# EAGLE design LiDAR_Demo_Board (EAGLE 9.2.2)
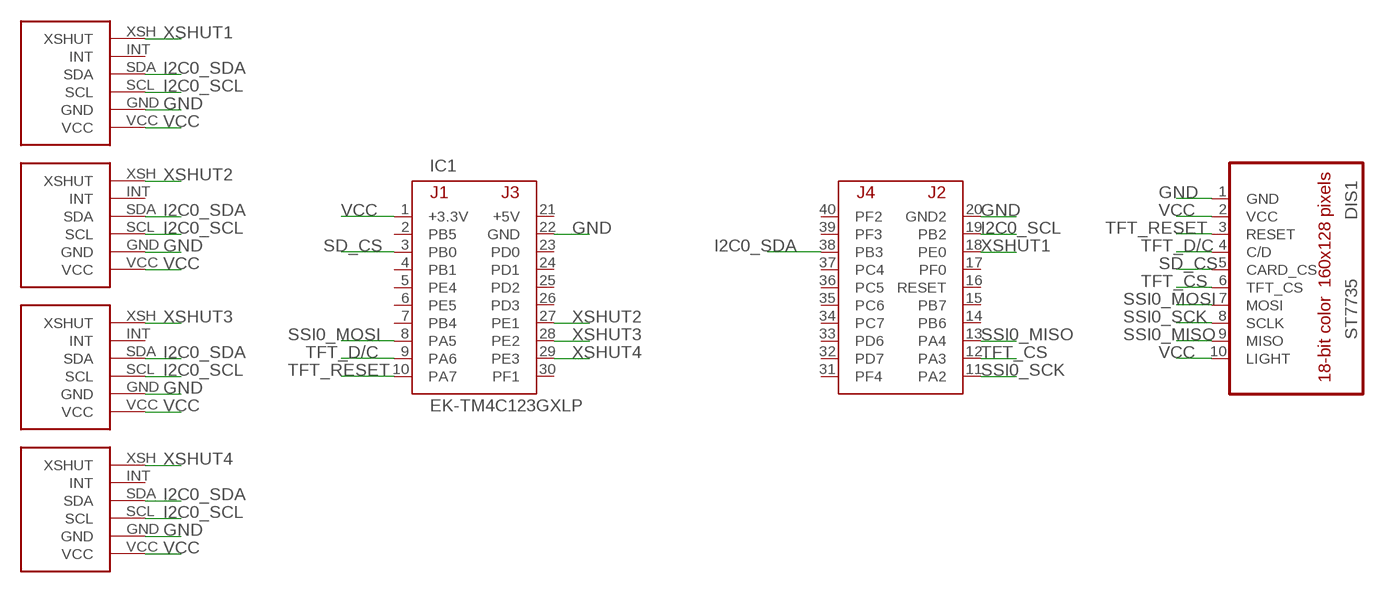
[diagram p0: schematic, sheet 1]

## Parts
DIS1  ST7735  [ST7735]
IC1  EK-TM4C123GXLP  [TM4C123LAUNCHPAD]
U$1  VL53L0X_ATK  [VL53L0X_ATK]
U$2  VL53L0X_ATK  [VL53L0X_ATK]
U$3  VL53L0X_ATK  [VL53L0X_ATK]
U$4  VL53L0X_ATK  [VL53L0X_ATK]

## Nets
GND: DIS1.1(GND) IC1.20(GND2) IC1.22(GND) U$1.GND U$2.GND U$3.GND U$4.GND
I2C0_SCL: IC1.19(PB2) U$1.SCL U$2.SCL U$3.SCL U$4.SCL
I2C0_SDA: IC1.38(PB3) U$1.SDA U$2.SDA U$3.SDA U$4.SDA
SD_CS: DIS1.5(CARD_CS) IC1.3(PB0)
SSI0_MISO: DIS1.9(MISO) IC1.13(PA4)
SSI0_MOSI: DIS1.7(MOSI) IC1.8(PA5)
SSI0_SCK: DIS1.8(SCLK) IC1.11(PA2)
TFT_CS: DIS1.6(TFT_CS) IC1.12(PA3)
TFT_D/C: DIS1.4(C/D) IC1.9(PA6)
TFT_RESET: DIS1.3(RESET) IC1.10(PA7)
VCC: DIS1.2(VCC) DIS1.10(LIGHT) IC1.1(+3.3V) U$1.VCC U$2.VCC U$3.VCC U$4.VCC
XSHUT1: IC1.18(PE0) U$1.XSH(XSHUT)
XSHUT2: IC1.27(PE1) U$2.XSH(XSHUT)
XSHUT3: IC1.28(PE2) U$3.XSH(XSHUT)
XSHUT4: IC1.29(PE3) U$4.XSH(XSHUT)
Unconnected: IC1.2(PB5) IC1.4(PB1) IC1.5(PE4) IC1.6(PE5) IC1.7(PB4) IC1.14(PB6) IC1.15(PB7) IC1.16(RESET) IC1.17(PF0) IC1.23(PD0) IC1.24(PD1) IC1.25(PD2) IC1.26(PD3) IC1.30(PF1) IC1.31(PF4) IC1.32(PD7) IC1.33(PD6) IC1.34(PC7) IC1.35(PC6) IC1.36(PC5) IC1.37(PC4) IC1.39(PF3) IC1.40(PF2) U$1.INT U$2.INT U$3.INT U$4.INT

## Power pins joined to a net without a drawn wire
+5V: IC1.21(+5V)

## Library data of the parts
DIS1 = UT_ECE:ST7735: Sitronix ST7735R 18-bit color, 1.8" TFT LCD display, 128*160, http://www.adafruit.com/products/358 // Backlight (pin 10) connected to +3.3 V // MISO (pin 9) PA4 (SSI0Rx) // SCK (pin 8) connected to PA2 (SSI0Clk) // MOSI (pin 7) connected to PA5 (SSI0Tx) // TFT_CS (pin 6) connected to PA3 (SSI0Fss) // CARD_CS (pin 5) connected to PD7 GPIO output(for SDC) // Data/Command (pin 4) connected to PA6 (GPIO), high for data, low for command // RESET (pin 3) connected to PA7 (GPIO) // VCC (pin 2) connected to +3.3 V // Gnd (pin 1) connected to ground; OC_FARNELL: unknown; OC_NEWARK: unknown
IC1 = UT_ECE:EK-TM4C123GXL: Texas Instruments TM4C123 LaunchPad EK-TM4C123GXL www.ti.com/tool/ek-tm4c123gxl
U$1-U$4 = Z:VL53L0X_ATK

## Board
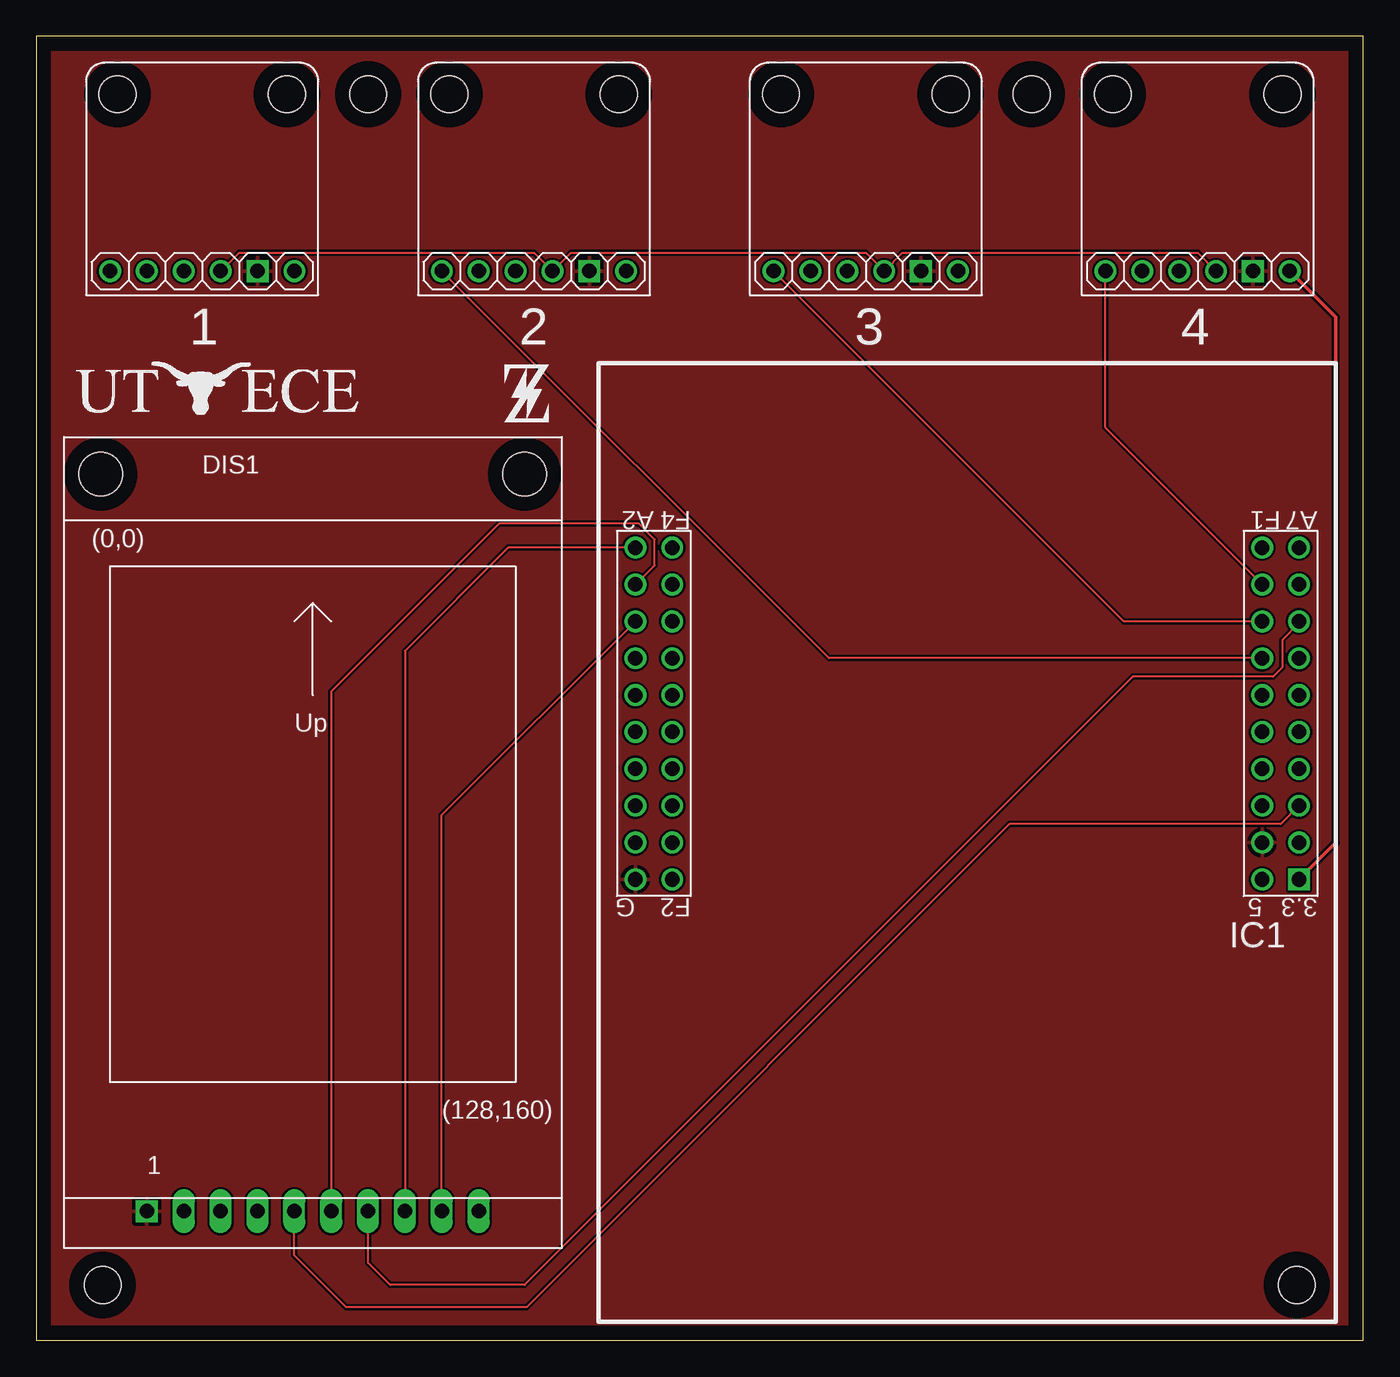
[diagram p1: board, top side]
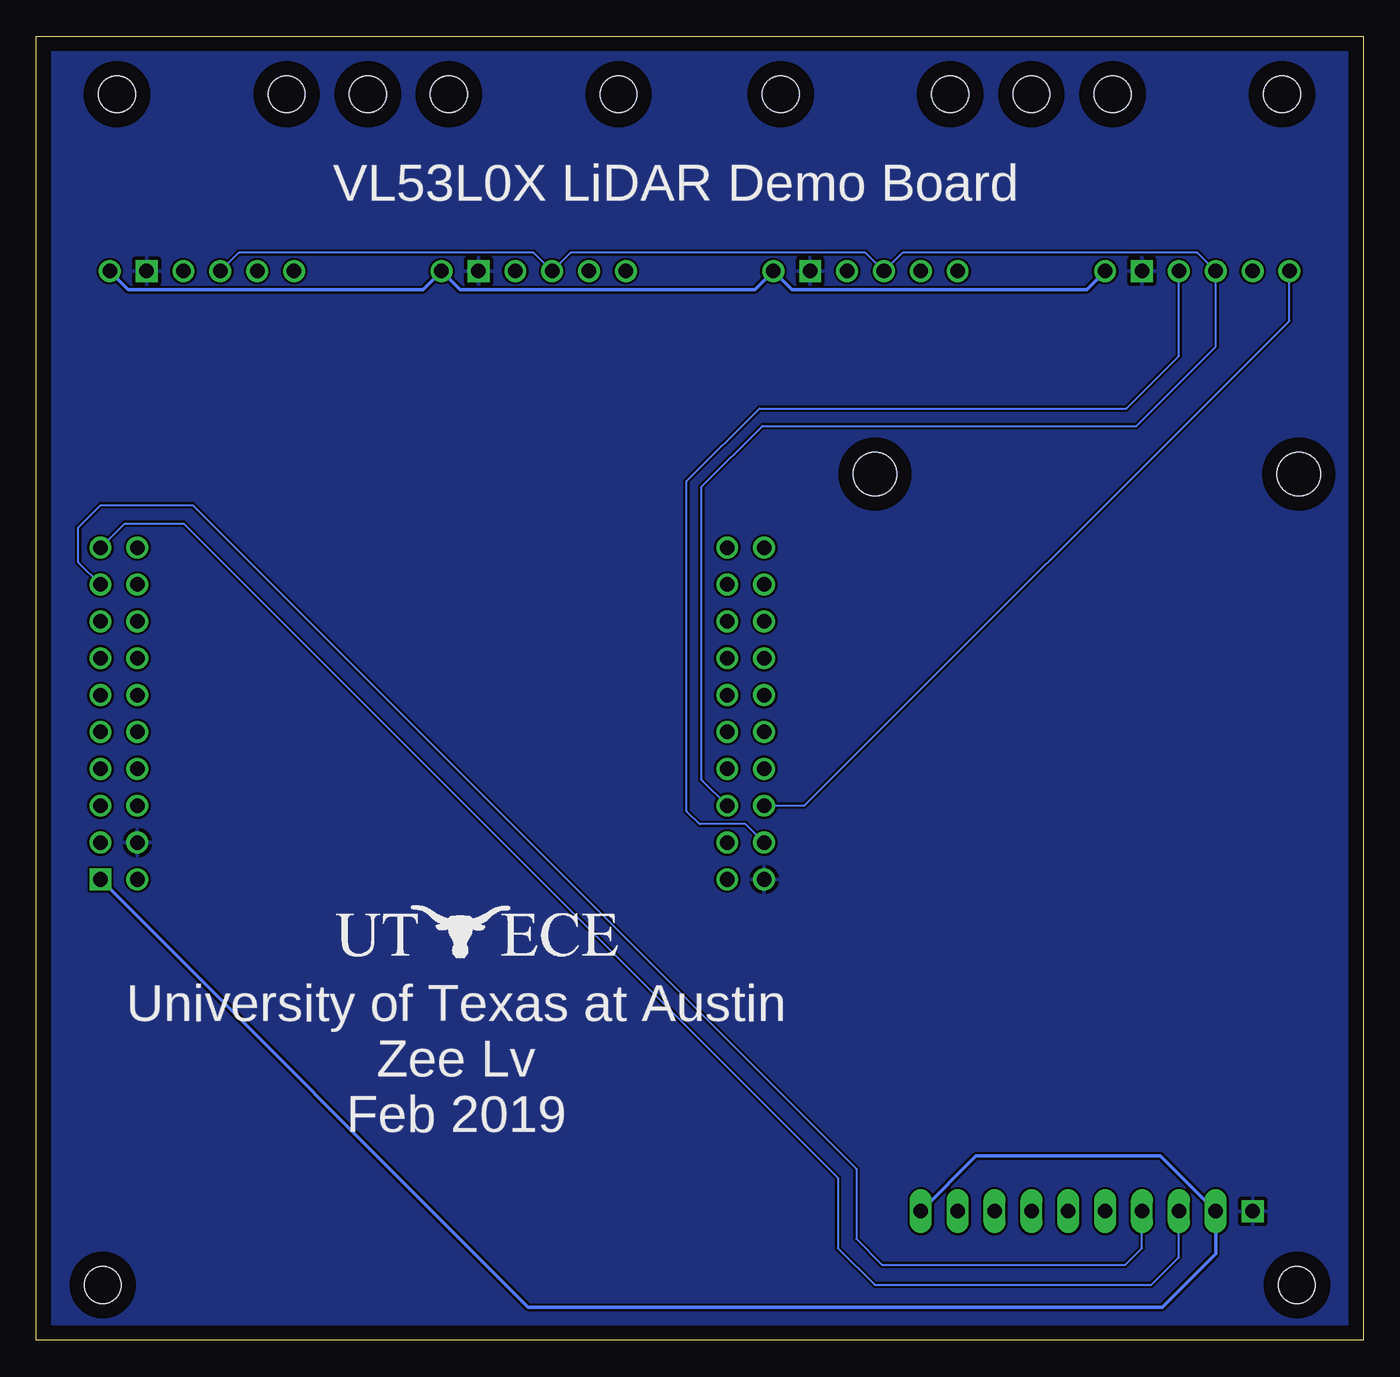
[diagram p2: board, bottom side, seen from below]

Size 91.42 x 89.84 mm. Coordinates in mm from the lower left corner, seen from the top.
Outline: 0,0 91.42,0 91.42,89.84 0,89.84 0,0
Copper layers (1*16): Top 0.035mm / dielectric 1.5mm / Bottom 0.035mm
Design rules "default": minimum track width 6mil, minimum drill 0.35mm, track to track 6mil, track to pad 6mil, pad to pad 6mil, via to via 6mil, smd to smd 6mil, copper to edge 40mil, drill to drill 6mil, minimum pad ring 10mil, minimum via ring 8mil, stop-mask expansion 4mil, vias tented up to drill 0mil, thermal gap 10mil
Holes 2.54 mm at 86.84,3.81 4.57,3.81 22.86,85.85 68.58,85.85

### Footprints (pad centres in the part's own frame; a part is rotated, then mirrored left to right if it is on the bottom)
ST7735 = drill 1 square: 1 -11.43,-30.48 | drill 1 long: 2 -8.89,-30.48; 3 -6.35,-30.48; 4 -3.81,-30.48; 5 -1.27,-30.48; 6 1.27,-30.48; 7 3.81,-30.48; 8 6.35,-30.48; 9 8.89,-30.48; 10 11.43,-30.48 | hole 3: -14.605,20.32; 14.605,20.32
TM4C123LAUNCHPAD = drill 1 square: 1 -22.86,12.7 | drill 1: 2 -22.86,10.16; 3 -22.86,7.62; 4 -22.86,5.08; 5 -22.86,2.54; 6 -22.86,0; 7 -22.86,-2.54; 8 -22.86,-5.08; 9 -22.86,-7.62; 10 -22.86,-10.16; 11 22.86,-10.16; 12 22.86,-7.62; 13 22.86,-5.08; 14 22.86,-2.54; 15 22.86,0; 16 22.86,2.54; 17 22.86,5.08; 18 22.86,7.62; 19 22.86,10.16; 20 22.86,12.7; 21 -20.32,12.7; 22 -20.32,10.16; 23 -20.32,7.62; 24 -20.32,5.08; 25 -20.32,2.54; 26 -20.32,0; 27 -20.32,-2.54; 28 -20.32,-5.08; 29 -20.32,-7.62; 30 -20.32,-10.16; 31 20.32,-10.16; 32 20.32,-7.62; 33 20.32,-5.08; 34 20.32,-2.54; 35 20.32,0; 36 20.32,2.54; 37 20.32,5.08; 38 20.32,7.62; 39 20.32,10.16; 40 20.32,12.7
VL53L0X_ATK = drill 1 square: GND 12.7,2.54 | drill 1: INT 5.08,2.54; SCL 10.16,2.54; SDA 7.62,2.54; VCC 15.24,2.54; XSH 2.54,2.54 | hole 2.54: 3.048,14.732; 14.732,14.732

### Placement (x,y rotation side)
DIS1  19.05,39.37 0 top
IC1  64.14,44.45 180 top
U$1  2.54,71.12 0 top
U$2  25.4,71.12 0 top
U$3  48.26,71.12 0 top
U$4  71.12,71.12 0 top
U$5  [LOGO_UT_ECE_20X4]  2.29,63.5 0 top
U$6  [LOGO_Z_3X4]  32.26,63.25 0 top
U$7  [LOGO_UT_ECE_20X4]  71.25,26.04 0 bottom

### Tracks (layer width: path | path; a pad name or v marks a point on that pad's centre or on a via)
GND
  pour Top: 0.13,89.66 0.13,0.13 91.31,0.13 91.31,89.66
  pour Bottom: 0.13,89.66 0.13,0.13 91.31,0.13 91.31,89.66
I2C0_SCL
  Top 0.152: U$1.SCL 13.97,74.93 34.29,74.93 U$2.SCL 36.83,74.93 57.15,74.93 U$3.SCL 59.69,74.93 80.01,74.93 U$4.SCL
  Bottom 0.152: IC1.19 42.55,35.56 45.72,35.56 46.61,36.45 46.61,59.18 41.59,64.2 16.32,64.2 12.7,67.82 U$1.SCL
I2C0_SDA
  Bottom 0.152: U$4.SDA 77.47,74.93 57.15,74.93 U$3.SDA 54.61,74.93 34.29,74.93 U$2.SDA 31.75,74.93 11.43,74.93 U$1.SDA 10.16,68.45 15.62,62.99 41.4,62.99 45.59,58.8 45.59,38.61 IC1.38
SD_CS
  Top 0.152: IC1.3 85.73,35.56 67.06,35.56 33.78,2.29 21.34,2.29 17.78,5.84 DIS1.5
SSI0_MISO
  Top 0.152: DIS1.9 27.94,36.2 IC1.13
SSI0_MOSI
  Top 0.152: IC1.8 86.99,49.4 85.85,48.26 85.85,46.35 85.22,45.72 75.57,45.72 33.66,3.81 24.38,3.81 22.86,5.33 DIS1.7
SSI0_SCK
  Top 0.152: IC1.11 32.51,54.61 25.4,47.5 DIS1.8
TFT_CS
  Top 0.152: IC1.12 42.48,53.28 42.55,53.34 42.61,53.4 42.61,55.18 41.53,56.26 31.88,56.26 20.32,44.7 DIS1.6
TFT_D/C
  Bottom 0.152: IC1.9 88.52,53.59 88.52,56.01 86.99,57.53 80.64,57.53 34.92,11.81 34.92,6.99 33.15,5.21 16.38,5.21 15.24,6.35 DIS1.4
TFT_RESET
  Bottom 0.152: IC1.10 85.34,56.26 81.28,56.26 36.2,11.18 36.2,6.35 33.66,3.81 14.61,3.81 12.7,5.71 DIS1.3
VCC
  Top 0.254: IC1.1 89.54,34.29 89.54,70.48 U$4.VCC
  Bottom 0.254: U$4.VCC 85.09,72.39 64.77,72.39 U$3.VCC 62.23,72.39 41.91,72.39 U$2.VCC 39.37,72.39 19.05,72.39 U$1.VCC | DIS1.10 26.67,12.7 13.97,12.7 DIS1.2 10.16,5.97 13.84,2.29 57.53,2.29 IC1.1
XSHUT1
  Bottom 0.152: U$1.XSH 5.08,70.23 38.48,36.83 IC1.18
XSHUT2
  Top 0.152: IC1.27 54.61,46.99 U$2.XSH
XSHUT3
  Top 0.152: IC1.28 74.93,49.53 U$3.XSH
XSHUT4
  Top 0.152: IC1.29 73.66,62.87 U$4.XSH

### Text on the board
tPlace: 1 | 2 | 3 | 4
bPlace: VL53L0X LiDAR Demo Board | University of Texas at Austin / Zee Lv / Feb 2019